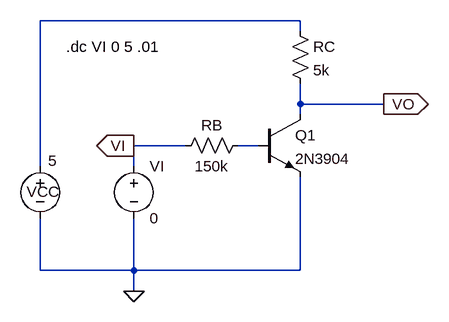
[diagram p0: schematic exam5_06_NPN.asc]
exam5_06_NPN.asc, the LTspice schematic file:
Version 4
SHEET 1 880 680
WIRE 272 -16 -128 -16
WIRE 272 0 272 -16
WIRE 272 112 272 80
WIRE 400 112 272 112
WIRE 272 128 272 112
WIRE 96 176 16 176
WIRE 208 176 176 176
WIRE -128 208 -128 -16
WIRE 16 208 16 176
WIRE -128 368 -128 288
WIRE 16 368 16 288
WIRE 16 368 -128 368
WIRE 272 368 272 224
WIRE 272 368 16 368
WIRE 16 400 16 368
FLAG 16 400 0
FLAG 400 112 VO
IOPIN 400 112 Out
FLAG 16 176 VI
IOPIN 16 176 Out
SYMBOL npn 208 128 R0
SYMATTR InstName Q1
SYMATTR Value 2N3904
SYMBOL res 256 -16 R0
SYMATTR InstName RC
SYMATTR Value 5k
SYMBOL res 192 160 R90
WINDOW 0 0 56 VBottom 2
WINDOW 3 32 56 VTop 2
SYMATTR InstName RB
SYMATTR Value 150k
SYMBOL voltage 16 192 R0
SYMATTR InstName VI
SYMATTR Value 0
SYMBOL voltage -128 192 R0
WINDOW 0 -21 55 Left 2
WINDOW 3 12 7 Left 2
SYMATTR InstName VCC
SYMATTR Value 5
TEXT -88 24 Left 2 !.dc VI 0 5 .01

The netlist it stands for:
* exam5_06_NPN.asc
Q1 VO N002 0 0 2N3904
RC N001 VO 5k
RB N002 VI 150k
VI VI 0 0
VCC N001 0 5
.model NPN NPN
.model PNP PNP
.lib standard.bjt
.dc VI 0 5 .01
.backanno
.end